# EAGLE design jBoard2 (EAGLE 7.7.0)
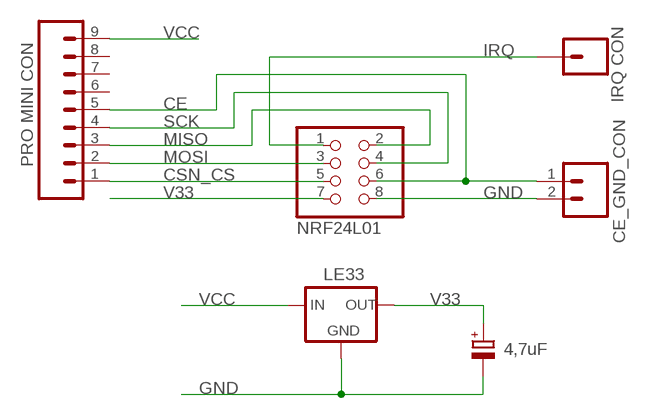
[diagram p0: schematic, sheet 1]

## Parts
C3  4,7uF  CPOL-EUE2-5  [E2-5]
IC1  LE33  78LXX  [78LXX]
J1  PRO MINI CON  M09  [1X09]
J2  IRQ CON  CONN_01  [1X01]
J3  CE_GND_CON  CONN_02  [1X02]
JP2  NRF24L01  PINHD-2X4  [2X04]

## Nets
CE: J1.5 J3.1 JP2.6
CSN_CS: J1.1 JP2.5
GND: C3.- IC1.GND J3.2 JP2.8
IRQ: J2.1 JP2.1
MISO: J1.3 JP2.2
MOSI: J1.2 JP2.3
SCK: J1.4 JP2.4
V33: C3.+ IC1.OUT JP2.7
VCC: IC1.IN J1.9
Unconnected: J1.6 J1.7 J1.8

## Library data of the parts
C3 = rcl:CPOL-EU: POLARIZED CAPACITOR, European symbol
IC1 = v-reg-3:78LXX: VOLTAGE REGULATOR
J1 = SparkFun-Connectors:M09: Header 9 Standard 9-pin 0.1" header. Use with straight break away headers (SKU : PRT-00116), right angle break away headers (PRT-00553), swiss pins (PRT-00743), machine pins (PRT-00117), and female headers (PRT-00115).
J2 = SparkFun-Connectors:CONN_01: Single connection point. Often used as Generic Header-pin footprint for 0.1 inch spaced/style header connections On any of the 0.1 inch spaced packages, you can populate with these: Break Away Headers - Straight <https://www.sparkfun.com/products/116> (PRT-00116) Break Away Male Headers - Right Angle <https://www.sparkfun.com/products/553> (PRT-00553) Female Headers <https://www.sparkfun.com/products/115> (PRT-00115) Break Away Headers - Machine Pin <https://www.sparkfun.com/products/117> (PRT-00117) Break Away Female Headers - Swiss Machine Pin <https://www.sparkfun.com/products/743> (PRT-00743) This device is also useful as a general connection point to wire up your design to another part of your project. Our various solder wires solder well into these plated through hole pads. Hook-Up Wire - Assortment (Stranded, 22 AWG) <https://www.sparkfun.com/products/11375> (PRT-11375) Hook-Up Wire - Assortment (Solid Core, 22 AWG) <https://www.sparkfun.com/products/11367> (PRT-11367) View the entire wire category on our website here <https://www.sparkfun.com/categories/141> Special notes: SMTSO-256-ET is a "flush mount" nut for a 4-40 screw. We mostly use this on specialty testbeds; it is a nice way to connect hardware to your PCB at an adjustable hieght. Also note, the SNAP packages are for using a snappable style connector. We sell a baggie of snaps and they are also used on two LilyPad designs: Snap Assortment - 30 pack (male and female) <https://www.sparkfun.com/products/11347> (DEV-11347) LilyPad Arduino SimpleSnap <https://www.sparkfun.com/products/10941> (DEV-10941) LilyPad SimpleSnap Protoboard <https://www.sparkfun.com/products/10940> (DEV-10940)
J3 = SparkFun-Connectors:CONN_02: Multi connection point. Often used as Generic Header-pin footprint for 0.1 inch spaced/style header connections On any of the 0.1 inch spaced packages, you can populate with these: Break Away Headers - Straight <https://www.sparkfun.com/products/116> (PRT-00116) Break Away Male Headers - Right Angle <https://www.sparkfun.com/products/553> (PRT-00553) Female Headers <https://www.sparkfun.com/products/115> (PRT-00115) Break Away Headers - Machine Pin <https://www.sparkfun.com/products/117> (PRT-00117) Break Away Female Headers - Swiss Machine Pin <https://www.sparkfun.com/products/743> (PRT-00743) For SCREWTERMINALS and SPRING TERMINALS visit here: Screw Terimnals on SparkFun.com <https://www.sparkfun.com/search/results?term=Screw+Terminals> (5mm/3.5mm/2.54mm spacing) This device is also useful as a general connection point to wire up your design to another part of your project. Our various solder wires solder well into these plated through hole pads. Hook-Up Wire - Assortment (Stranded, 22 AWG) <https://www.sparkfun.com/products/11375> (PRT-11375) Hook-Up Wire - Assortment (Solid Core, 22 AWG) <https://www.sparkfun.com/products/11367> (PRT-11367) View the entire wire category on our website here <https://www.sparkfun.com/categories/141> Special notes: Molex polarized connector foot print use with: PRT-08233 with associated crimp pins and housings. 2.54_SCREWTERM for use with PRT-10571. 3.5mm Screw Terminal footprints for PRT-08084 5mm Screw Terminal footprints for use with PRT-08432
JP2 = pinhead:PINHD-2X4: PIN HEADER

## Board
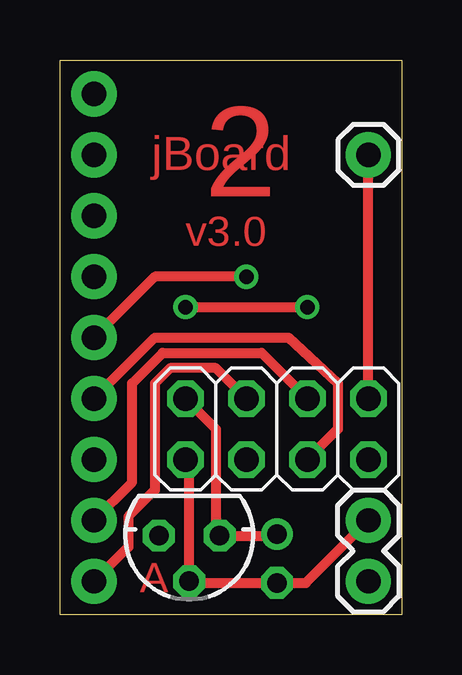
[diagram p1: board, top side]
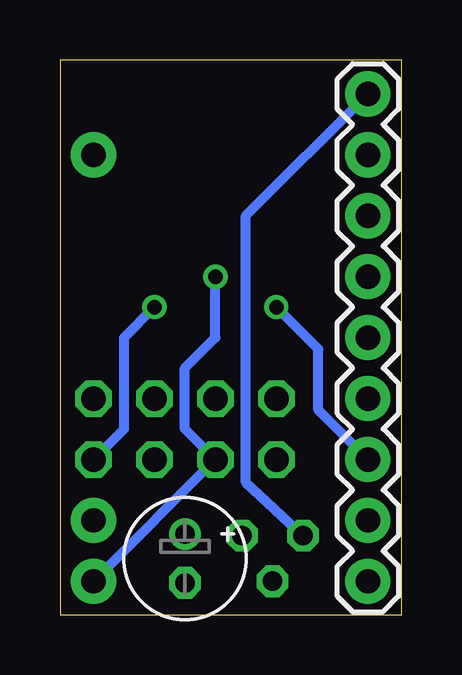
[diagram p2: board, bottom side, seen from below]

Size 14.24 x 23.14 mm. Coordinates in mm from the lower left corner, seen from the top.
Outline: 14.24,0 0,0 0,23.14 14.24,23.14 14.24,0
Copper layers (1*16): Top 0.035mm / dielectric 1.5mm / Bottom 0.035mm
Design rules "default": minimum track width 10mil, minimum drill 24mil, track to track 8mil, track to pad 8mil, pad to pad 8mil, via to via 8mil, smd to smd 8mil, copper to edge 40mil, drill to drill 8mil, minimum pad ring 10mil, minimum via ring 8mil, stop-mask expansion 4mil, vias tented up to drill 0mil, thermal gap 10mil

### Footprints (pad centres in the part's own frame; a part is rotated, then mirrored left to right if it is on the bottom)
E2-5 = drill 0.813 pad 1.27: + -1.016,0 | drill 0.813 pad 1.27 octagon: - 1.016,0
78LXX = drill 0.813 octagon: GND 0,1.905; IN 1.27,0; OUT -1.27,0
1X09 = drill 1.016 pad 1.88: 1 0,0; 2 2.54,0; 3 5.08,0; 4 7.62,0; 5 10.16,0; 6 12.7,0; 7 15.24,0; 8 17.78,0; 9 20.32,0
1X01 = drill 1.016 pad 1.88: 1 0,0
1X02 = drill 1.016 pad 1.88: 1 0,0; 2 2.54,0
2X04 = drill 1.016 octagon: 1 -3.81,-1.27; 2 -3.81,1.27; 3 -1.27,-1.27; 4 -1.27,1.27; 5 1.27,-1.27; 6 1.27,1.27; 7 3.81,-1.27; 8 3.81,1.27

### Placement (x,y rotation side)
C3  9.04,2.35 270 bottom
IC1  5.38,3.3 180 top
J1  1.42,1.4 90 bottom
J2  12.85,19.18 0 top
J3  12.85,1.4 90 top
JP2  9.04,7.75 180 top

### Tracks (layer width: path | path; a pad name or v marks a point on that pad's centre or on a via)
CE  (via drill 0.6)
  Top 0.406: v7.77,14.1 3.96,14.1 J1.5
  Bottom 0.406: v7.77,14.1 7.77,11.56 9.04,10.29 9.04,7.75 JP2.6 J3.1
CSN_CS
  Top 0.406: JP2.5 6.5,10.29 4.59,10.29 3.96,9.65 3.96,5.21 2.85,4.1 2.85,2.83 J1.1
GND
  Top 0.406: JP2.8 5.39,6.32 IC1.GND 5.48,1.33 C3.- 10.24,1.33 J3.2
IRQ
  Top 0.406: JP2.1 J2.1
MISO  (via drill 0.6)
  Top 0.406: v5.23,12.83 v10.31,12.83
  Bottom 0.406: J1.3 3.48,8.54 3.48,11.08 v5.23,12.83 | JP2.2 11.58,7.75 11.58,11.56 v10.31,12.83
MOSI
  Top 0.406: JP2.3 8.4,10.92 4.27,10.92 3,9.65 3,5.52 J1.2
SCK
  Top 0.406: J1.4 3.96,11.56 9.51,11.56 11.58,9.65 11.58,7.75 JP2.4
V33
  Top 0.406: JP2.7 6.5,7.75 6.5,3.46 IC1.OUT 8.97,3.3 C3.+
VCC
  Bottom 0.406: IC1.IN 6.5,5.52 6.5,16.64 J1.9

### Text on the board
Top: jBoard | 2 | v3.0 | A